# Altium schematic sheet Filters.2.SchDoc
size A; SheetNumber: 2; SheetTotal: 3
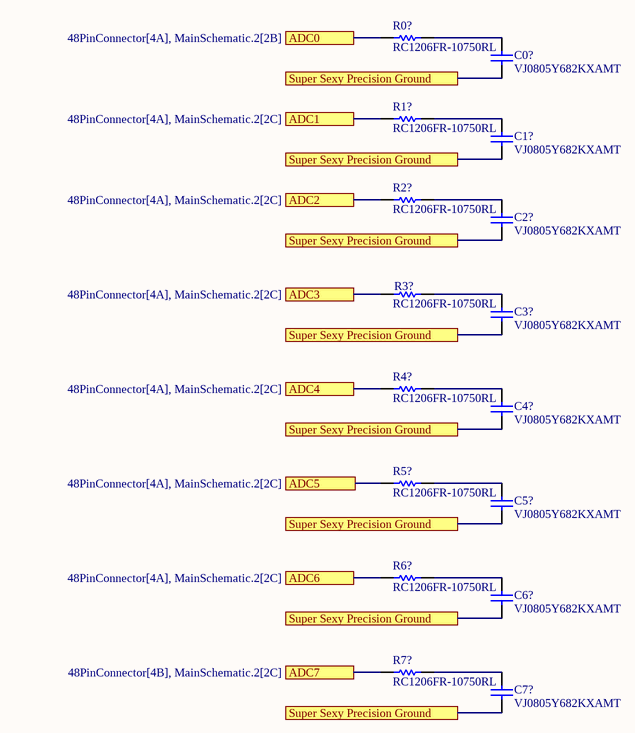
[diagram p0: Filters.2.SchDoc]

## Parts
C0?  VJ0805Y682KXAMT  [CAPC2013X145X48ML20T23]
C1?  VJ0805Y682KXAMT  [CAPC2013X145X48ML20T23]
C2?  VJ0805Y682KXAMT  [CAPC2013X145X48ML20T23]
C3?  VJ0805Y682KXAMT  [CAPC2013X145X48ML20T23]
C4?  VJ0805Y682KXAMT  [CAPC2013X145X48ML20T23]
C5?  VJ0805Y682KXAMT  [CAPC2013X145X48ML20T23]
C6?  VJ0805Y682KXAMT  [CAPC2013X145X48ML20T23]
C7?  VJ0805Y682KXAMT  [CAPC2013X145X48ML20T23]
R0?  RC1206FR-10750RL  [RESC3116X65X40LL10T20]
R1?  RC1206FR-10750RL  [RESC3116X65X40LL10T20]
R2?  RC1206FR-10750RL  [RESC3116X65X40LL10T20]
R3?  RC1206FR-10750RL  [RESC3116X65X40LL10T20]
R4?  RC1206FR-10750RL  [RESC3116X65X40LL10T20]
R5?  RC1206FR-10750RL  [RESC3116X65X40LL10T20]
R6?  RC1206FR-10750RL  [RESC3116X65X40LL10T20]
R7?  RC1206FR-10750RL  [RESC3116X65X40LL10T20]

## Ports
ADC0 (see 48PinConnector[4A], MainSchematic.2[2B]), ADC1 (see 48PinConnector[4A], MainSchematic.2[2C]), ADC2 (see 48PinConnector[4A], MainSchematic.2[2C]), ADC3 (see 48PinConnector[4A], MainSchematic.2[2C]), ADC4 (see 48PinConnector[4A], MainSchematic.2[2C]), ADC5 (see 48PinConnector[4A], MainSchematic.2[2C]), ADC6 (see 48PinConnector[4A], MainSchematic.2[2C]), ADC7 (see 48PinConnector[4B], MainSchematic.2[2C]), Super Sexy Precision Ground (see 48PinConnector[3A], 48PinConnector[3B], 48PinConnector[3C], Filters.2[1A], Filters.2[1B], Filters.2[1C], MainSchematic.2[2C], MainSchematic.2[5B])

## Nets
ADC0: R0?.1 ; port ADC0
ADC1: R1?.1 ; port ADC1
ADC2: R2?.1 ; port ADC2
ADC3: R3?.1 ; port ADC3
ADC4: R4?.1 ; port ADC4
ADC5: R5?.1 ; port ADC5
ADC6: R6?.1 ; port ADC6
ADC7: R7?.1 ; port ADC7
Super Sexy Precision Ground: C0?.1 C1?.1 C2?.1 C3?.1 C4?.1 C5?.1 C6?.1 C7?.1 ; port Super Sexy Precision Ground
NetC0?_2: C0?.2 R0?.2
NetC1?_2: C1?.2 R1?.2
NetC2?_2: C2?.2 R2?.2
NetC3?_2: C3?.2 R3?.2
NetC4?_2: C4?.2 R4?.2
NetC5?_2: C5?.2 R5?.2
NetC6?_2: C6?.2 R6?.2
NetC7?_2: C7?.2 R7?.2

## Library data of the parts
C0? C1? C2? C3? C4? C5? C6? C7? = CMP-2007-03205-1: Manufacturer: Vitramon; Part Number: VJ0805Y682KXAMT
R0? R1? R2? R3? R4? R5? R6? R7? = CMP-2003-04964-1: Manufacturer: Yageo; Part Number: RC1206FR-10750RL